# EAGLE design lcd-alt1 (EAGLE 5.11)
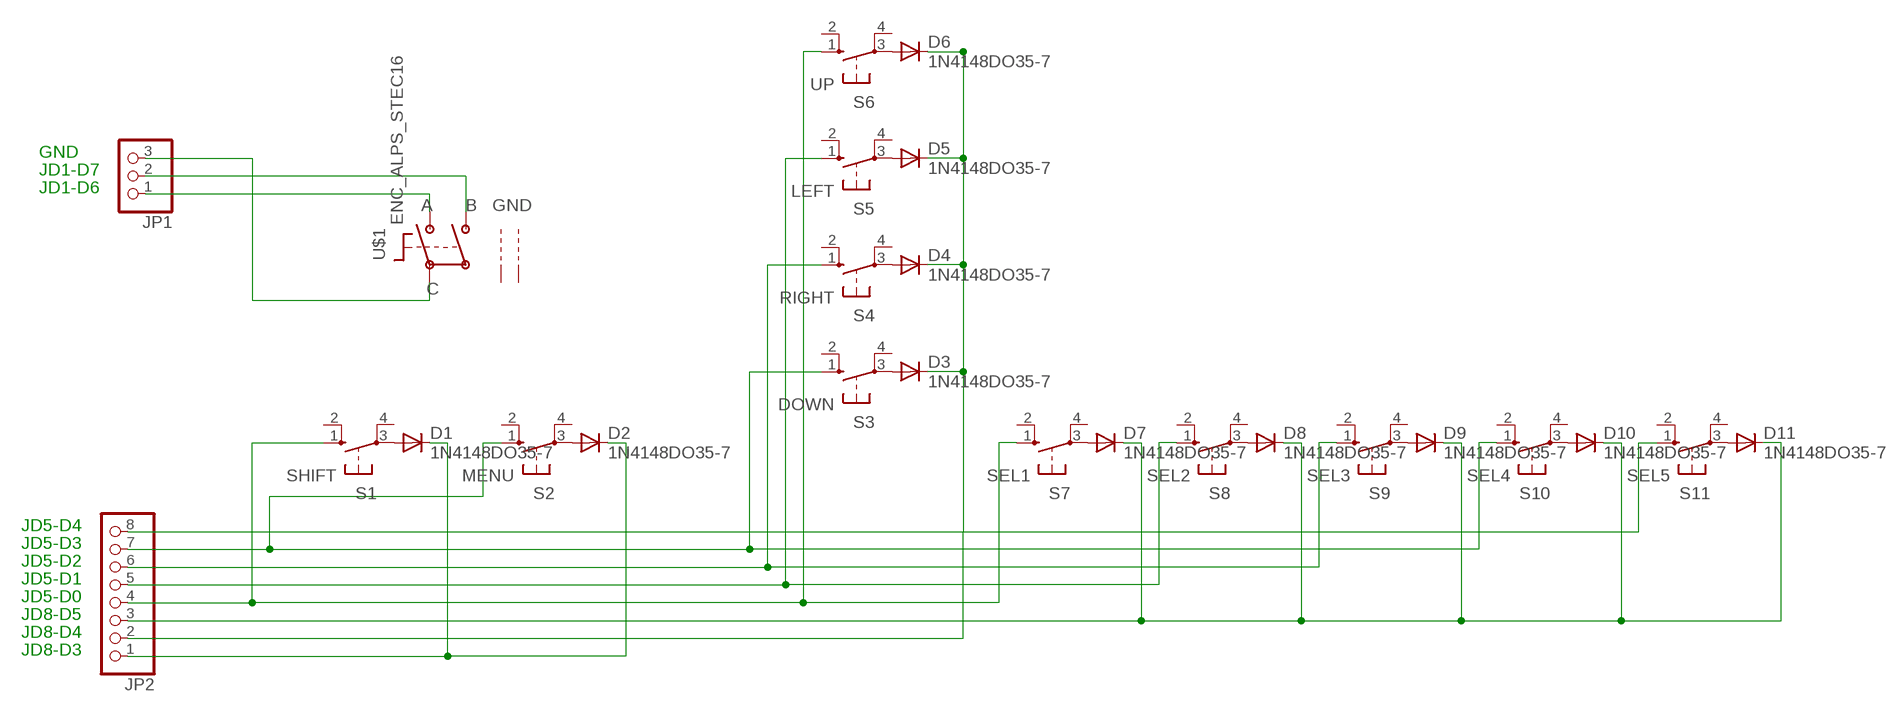
[diagram p0: schematic, sheet 1]

## Parts
D1  1N4148DO35-7  DIODE-DO214AC  [DO214AC]
D2  1N4148DO35-7  DIODE-DO214AC  [DO214AC]
D3  1N4148DO35-7  DIODE-DO214AC  [DO214AC]
D4  1N4148DO35-7  DIODE-DO214AC  [DO214AC]
D5  1N4148DO35-7  DIODE-DO214AC  [DO214AC]
D6  1N4148DO35-7  DIODE-DO214AC  [DO214AC]
D7  1N4148DO35-7  DIODE-DO214AC  [DO214AC]
D8  1N4148DO35-7  DIODE-DO214AC  [DO214AC]
D9  1N4148DO35-7  DIODE-DO214AC  [DO214AC]
D10  1N4148DO35-7  DIODE-DO214AC  [DO214AC]
D11  1N4148DO35-7  DIODE-DO214AC  [DO214AC]
JP1  PINHD-1X3  [1X03]
JP2  PINHD-1X8  [1X08]
S1  SHIFT  10-XX  [B3F-10XX]
S2  MENU  10-XX  [B3F-10XX]
S3  DOWN  10-XX  [B3F-10XX]
S4  RIGHT  10-XX  [B3F-10XX]
S5  LEFT  10-XX  [B3F-10XX]
S6  UP  10-XX  [B3F-10XX]
S7  SEL1  10-XX  [B3F-10XX]
S8  SEL2  10-XX  [B3F-10XX]
S9  SEL3  10-XX  [B3F-10XX]
S10  SEL4  10-XX  [B3F-10XX]
S11  SEL5  10-XX  [B3F-10XX]
U$1  ENC_ALPS_STEC16  [STEC16]

## Nets
N$1: JP1.2 U$1.P$B
N$2: JP1.1 U$1.P$A
N$3: JP1.3 U$1.P$C
N$4: JP2.7 S2.1(S) S3.1(S) S10.1(S)
N$5: D1.A S1.3(P)
N$6: D2.A S2.3(P)
N$7: D3.A S3.3(P)
N$8: D4.A S4.3(P)
N$9: D5.A S5.3(P)
N$10: D6.A S6.3(P)
N$11: D7.A S7.3(P)
N$12: D8.A S8.3(P)
N$13: D9.A S9.3(P)
N$14: D10.A S10.3(P)
N$15: D11.A S11.3(P)
N$16: D1.C D2.C JP2.1
N$17: JP2.4 S1.1(S) S6.1(S) S7.1(S)
N$18: D3.C D4.C D5.C D6.C JP2.2
N$19: D7.C D8.C D9.C D10.C D11.C JP2.3
N$20: JP2.5 S5.1(S) S8.1(S)
N$21: JP2.6 S4.1(S) S9.1(S)
N$22: JP2.8 S11.1(S)
Unconnected: S1.2(S1) S1.4(P1) S2.2(S1) S2.4(P1) S3.2(S1) S3.4(P1) S4.2(S1) S4.4(P1) S5.2(S1) S5.4(P1) S6.2(S1) S6.4(P1) S7.2(S1) S7.4(P1) S8.2(S1) S8.4(P1) S9.2(S1) S9.4(P1) S10.2(S1) S10.4(P1) S11.2(S1) S11.4(P1) U$1.P$GND1 U$1.P$GND2

## Notes on the sheet
- GND
- JD1-D7
- JD1-D6
- JD5-D4
- JD5-D3
- JD5-D2
- JD5-D1
- JD5-D0
- JD8-D5
- JD8-D4
- JD8-D3

## Library data of the parts
D1-D11 = diode:DIODE-: DIODE
JP1 = pinhead:PINHD-1X3: PIN HEADER
JP2 = pinhead:PINHD-1X8: PIN HEADER
S1-S11 = switch-omron:10-XX: OMRON SWITCH; MPN: B3F-1000; OC_FARNELL: 176432; OC_NEWARK: 36M3542
U$1 = encoder:ENC

## Board
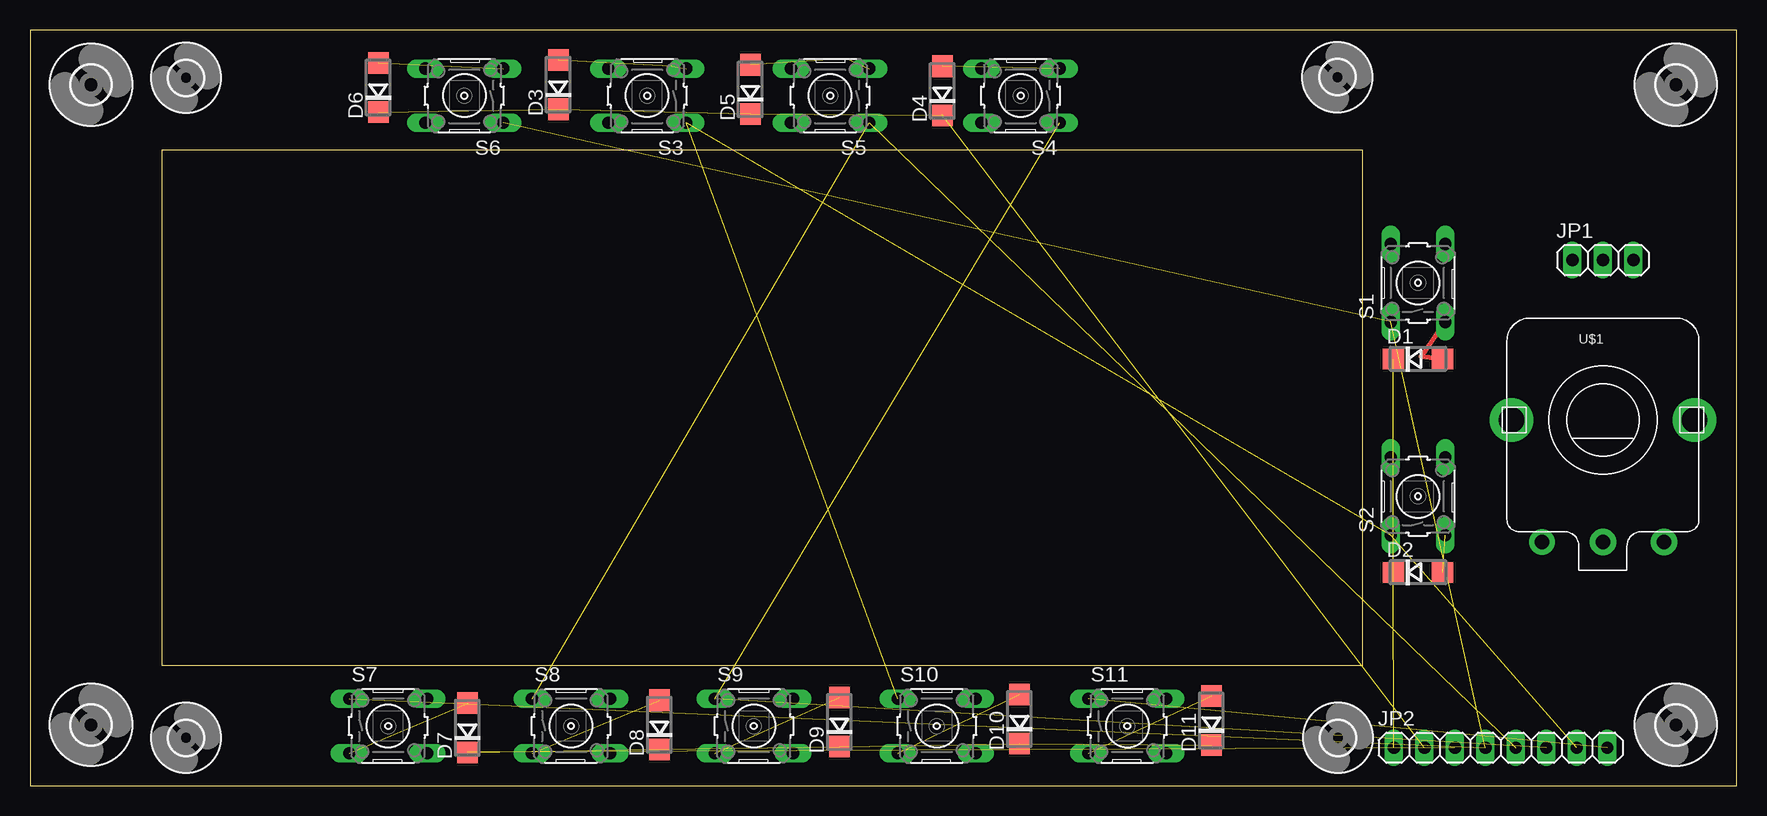
[diagram p1: board, top side]
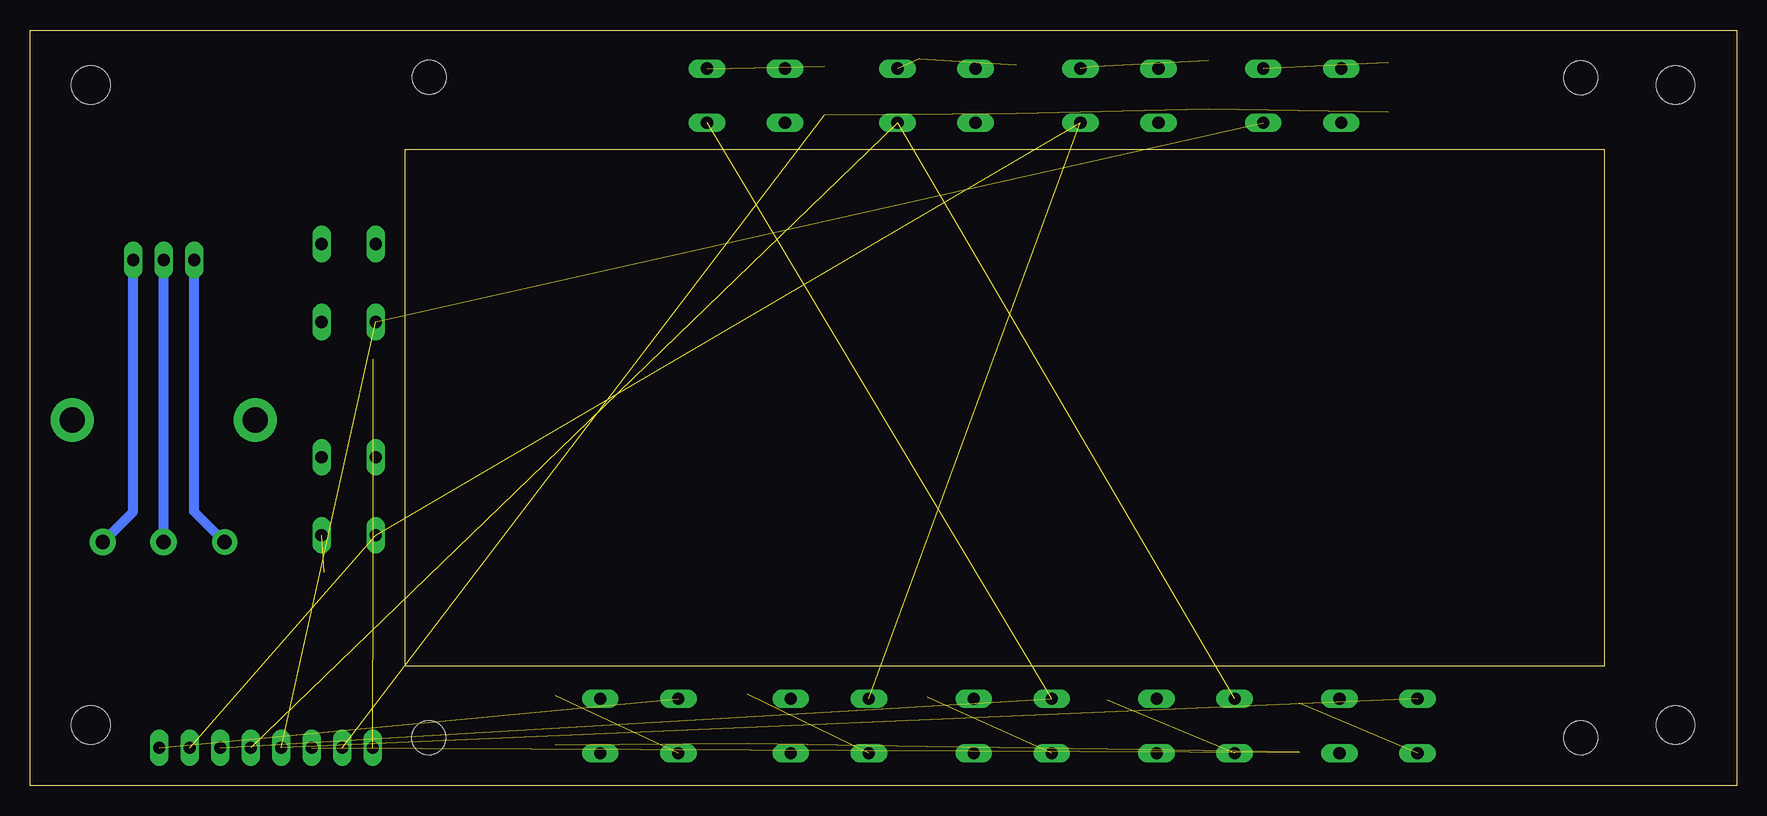
[diagram p2: board, bottom side, seen from below]

Size 142.22 x 62.99 mm. Coordinates in mm from the lower left corner, seen from the top.
Outline: 0,0 142.22,0 142.22,62.99 0,62.99 0,0
Outline: 11,53 111,53 111,10 11,10 11,53
Copper layers (1*16): Top 0.035mm / dielectric 1.5mm / Bottom 0.035mm
Design rules "default *": minimum track width 10mil, minimum drill 20mil, track to track 8mil, track to pad 8mil, pad to pad 8mil, via to via 8mil, smd to smd 8mil, copper to edge 40mil, drill to drill 8mil, minimum pad ring 10mil, minimum via ring 8mil, stop-mask expansion 4mil, vias tented up to drill 0mil, thermal gap 10mil

### Footprints (pad centres in the part's own frame; a part is rotated, then mirrored left to right if it is on the bottom)
DO214AC = smd 1.8 x 1.7: A 2.05,0; C -2.05,0
1X03 = drill 1.016 long: 1 -2.54,0; 2 0,0; 3 2.54,0
1X08 = drill 1.016 long: 1 -8.89,0; 2 -6.35,0; 3 -3.81,0; 4 -1.27,0; 5 1.27,0; 6 3.81,0; 7 6.35,0; 8 8.89,0
B3F-10XX = drill 1.016 long: 1 -3.251,2.261; 2 3.251,2.261; 3 -3.251,-2.261; 4 3.251,-2.261
STEC16 = drill 1.2 pad 2.1 round: P$A -5.08,-10.16 | drill 1.2 pad 2.2 round: P$B 0,-10.16; P$C 5.08,-10.16 | drill 2.1 pad 3.6 round: P$GND1 -7.62,0; P$GND2 7.62,0
3,2 = hole 3.2: 0,0
2,8 = hole 2.8: 0,0

### Placement (x,y rotation side)
D1  115.67,35.56 0 top
D2  115.67,17.78 0 top
D3  44.04,58.44 90 top
D4  76.04,57.91 90 top
D5  60.04,58.04 90 top
D6  29.04,58.2 90 top
D7  36.46,4.84 90 top
D8  52.46,5.08 90 top
D9  67.46,5.33 90 top
D10  82.46,5.57 90 top
D11  98.46,5.44 90 top
JP1  131.08,43.81 0 top
JP2  122.56,3.17 0 top
S1  115.67,41.91 90 top
S2  115.67,24.13 90 top
S3  51.44,57.52 180 top
S4  82.55,57.52 180 top
S5  66.67,57.52 180 top
S6  36.2,57.52 180 top
S7  29.84,4.99 0 top
S8  45.09,4.99 0 top
S9  60.33,4.99 0 top
S10  75.56,4.99 0 top
S11  91.44,4.99 0 top
U$1  131.08,30.48 0 top
U$2  [3,2]  5.08,58.42 0 top
U$3  [3,2]  5.08,5.08 0 top
U$4  [3,2]  137.16,58.42 0 top
U$5  [3,2]  137.16,5.08 0 top
U$6  [2,8]  13,4 0 top
U$7  [2,8]  109,4 0 top
U$8  [2,8]  13,59 0 top
U$10  [2,8]  108.95,59.05 0 top

### Tracks (layer width: path | path; a pad name or v marks a point on that pad's centre or on a via)
N$1
  Bottom 0.813: U$1.P$B JP1.2
N$2
  Bottom 0.813: JP1.1 128.54,22.86 U$1.P$A
N$3
  Bottom 0.813: JP1.3 133.62,22.86 U$1.P$C
N$4  (3 unrouted)
N$5
  Top 0.406: S1.3 115.93,35.77 D1.A
N$6  (1 unrouted)
N$7  (2 unrouted)
N$8  (1 unrouted)
N$9  (2 unrouted)
N$10  (1 unrouted)
N$11  (1 unrouted)
N$12  (1 unrouted)
N$13  (1 unrouted)
N$14  (1 unrouted)
N$15  (1 unrouted)
N$16  (2 unrouted)
N$17  (3 unrouted)
N$18  (4 unrouted)
N$19  (5 unrouted)
N$20  (2 unrouted)
N$21  (2 unrouted)
N$22  (1 unrouted)